# EAGLE design ACsaver-4 (EAGLE 5.11)
EAGLEUP: TC38H
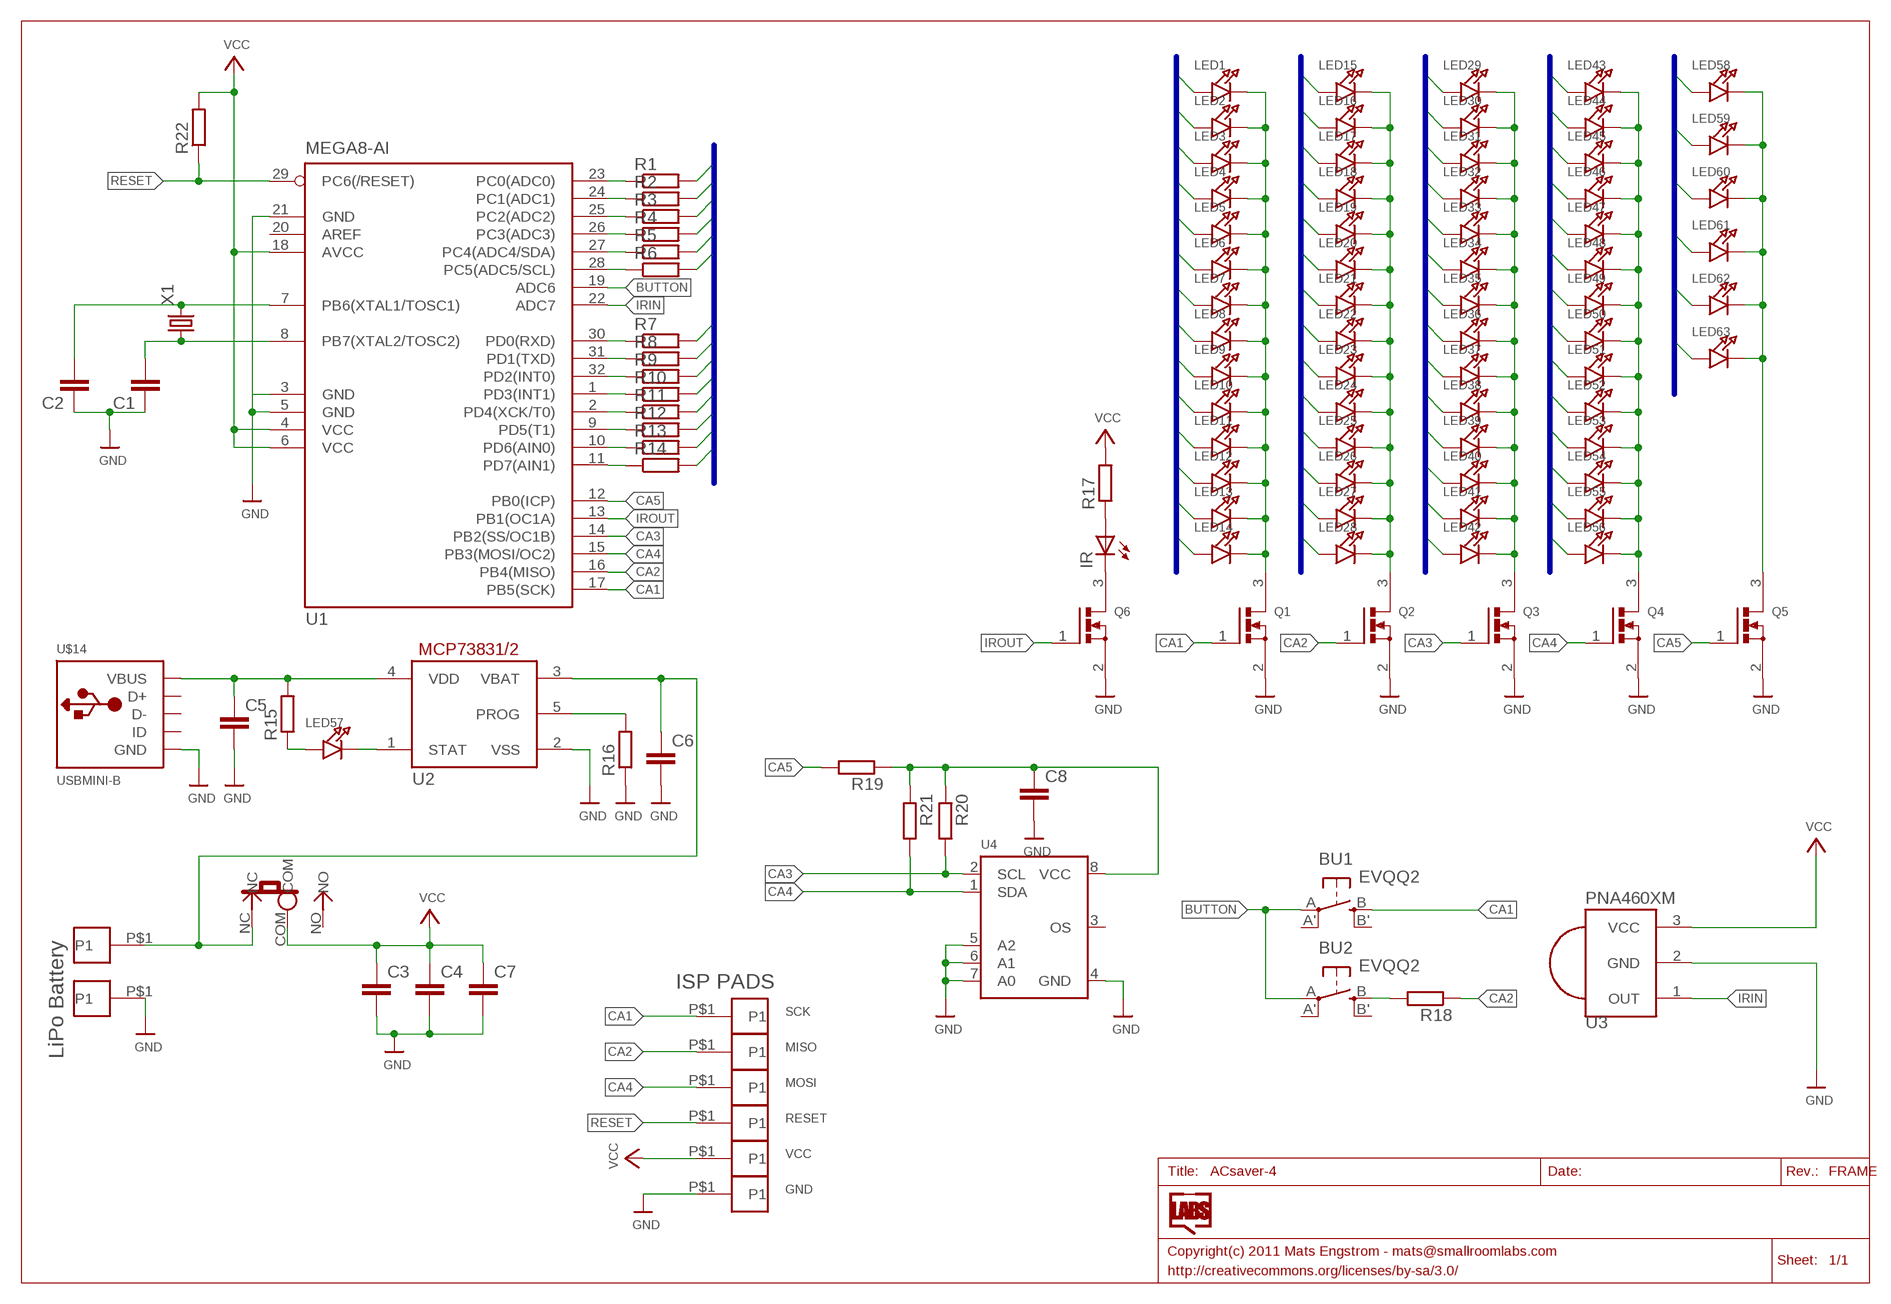
[diagram p0: schematic, sheet 1]

## Parts
BU1  EVQQ2  [EVQ-Q2]
BU2  EVQQ2  [EVQ-Q2]
C1  C-EUC0603  [C0603]
C2  C-EUC0603  [C0603]
C3  C-EUC0805  [C0805]
C4  C-EUC0805  [C0805]
C5  C-EUC0805  [C0805]
C6  C-EUC0805  [C0805]
C7  C-EUC0805  [C0805]
C8  C-EUC0805  [C0805]
IR  LED5MM  [LED5MM]
LED1  LED0805  [CHIPLED_0805]
LED2  LED0805  [CHIPLED_0805]
LED3  LED0805  [CHIPLED_0805]
LED4  LED0805  [CHIPLED_0805]
LED5  LED0805  [CHIPLED_0805]
LED6  LED0805  [CHIPLED_0805]
LED7  LED0805  [CHIPLED_0805]
LED8  LED0805  [CHIPLED_0805]
LED9  LED0805  [CHIPLED_0805]
LED10  LED0805  [CHIPLED_0805]
LED11  LED0805  [CHIPLED_0805]
LED12  LED0805  [CHIPLED_0805]
LED13  LED0805  [CHIPLED_0805]
LED14  LED0805  [CHIPLED_0805]
LED15  LED0805  [CHIPLED_0805]
LED16  LED0805  [CHIPLED_0805]
LED17  LED0805  [CHIPLED_0805]
LED18  LED0805  [CHIPLED_0805]
LED19  LED0805  [CHIPLED_0805]
LED20  LED0805  [CHIPLED_0805]
LED21  LED0805  [CHIPLED_0805]
LED22  LED0805  [CHIPLED_0805]
LED23  LED0805  [CHIPLED_0805]
LED24  LED0805  [CHIPLED_0805]
LED25  LED0805  [CHIPLED_0805]
LED26  LED0805  [CHIPLED_0805]
LED27  LED0805  [CHIPLED_0805]
LED28  LED0805  [CHIPLED_0805]
LED29  LED0805  [CHIPLED_0805]
LED30  LED0805  [CHIPLED_0805]
LED31  LED0805  [CHIPLED_0805]
LED32  LED0805  [CHIPLED_0805]
LED33  LED0805  [CHIPLED_0805]
LED34  LED0805  [CHIPLED_0805]
LED35  LED0805  [CHIPLED_0805]
LED36  LED0805  [CHIPLED_0805]
LED37  LED0805  [CHIPLED_0805]
LED38  LED0805  [CHIPLED_0805]
LED39  LED0805  [CHIPLED_0805]
LED40  LED0805  [CHIPLED_0805]
LED41  LED0805  [CHIPLED_0805]
LED42  LED0805  [CHIPLED_0805]
LED43  LED0805  [CHIPLED_0805]
LED44  LED0805  [CHIPLED_0805]
LED45  LED0805  [CHIPLED_0805]
LED46  LED0805  [CHIPLED_0805]
LED47  LED0805  [CHIPLED_0805]
LED48  LED0805  [CHIPLED_0805]
LED49  LED0805  [CHIPLED_0805]
LED50  LED0805  [CHIPLED_0805]
LED51  LED0805  [CHIPLED_0805]
LED52  LED0805  [CHIPLED_0805]
LED53  LED0805  [CHIPLED_0805]
LED54  LED0805  [CHIPLED_0805]
LED55  LED0805  [CHIPLED_0805]
LED56  LED0805  [CHIPLED_0805]
LED57  LED0805  [CHIPLED_0805]
LED58  LED0805  [CHIPLED_0805]
LED59  LED0805  [CHIPLED_0805]
LED60  LED0805  [CHIPLED_0805]
LED61  LED0805  [CHIPLED_0805]
LED62  LED0805  [CHIPLED_0805]
LED63  LED0805  [CHIPLED_0805]
P1  PAD5X7  [PAD5X7MM]
P2  PAD5X7  [PAD5X7MM]
P3  PADPAD1.5X2.5  [PAD1.5X2.5]
P4  PADPAD1.5X2.5  [PAD1.5X2.5]
P5  PADPAD1.5X2.5  [PAD1.5X2.5]
P6  PADPAD1.5X2.5  [PAD1.5X2.5]
P7  PADPAD1.5X2.5  [PAD1.5X2.5]
P8  PADPAD1.5X2.5  [PAD1.5X2.5]
Q1  MOSFET-NREFLOW  [SOT23-R]
Q2  MOSFET-NREFLOW  [SOT23-R]
Q3  MOSFET-NREFLOW  [SOT23-R]
Q4  MOSFET-NREFLOW  [SOT23-R]
Q5  MOSFET-NREFLOW  [SOT23-R]
Q6  MOSFET-NREFLOW  [SOT23-R]
R1  R-EU_R0603  [R0603]
R2  R-EU_R0603  [R0603]
R3  R-EU_R0603  [R0603]
R4  R-EU_R0603  [R0603]
R5  R-EU_R0603  [R0603]
R6  R-EU_R0603  [R0603]
R7  R-EU_R0603  [R0603]
R8  R-EU_R0603  [R0603]
R9  R-EU_R0603  [R0603]
R10  R-EU_R0603  [R0603]
R11  R-EU_R0603  [R0603]
R12  R-EU_R0603  [R0603]
R13  R-EU_R0603  [R0603]
R14  R-EU_R0603  [R0603]
R15  R-EU_R0603  [R0603]
R16  R-EU_R0603  [R0603]
R17  R-EU_R0603  [R0603]
R18  R-EU_R0603  [R0603]
R19  R-EU_R0603  [R0603]
R20  R-EU_R0603  [R0603]
R21  R-EU_R0603  [R0603]
R22  R-EU_R0603  [R0603]
SW1  SLIDESWITCH-PCM12  [PCM12]
U1  MEGA8-AI  [TQFP32-08]
U2  MCP73831/OT  [SOT23-5L]
U3  PNA460XM  [PNA460XM]
U4  LM75BSOIC  [SOIC8]
U$14  USBMINI-B  [MOLEX67503]
X1  CRYSTALTC26H  [TC26H]

## Nets
AN1: LED1.A LED15.A LED29.A LED43.A LED58.A R1.2
AN2: LED2.A LED16.A LED30.A LED44.A LED59.A R2.2
AN3: LED3.A LED17.A LED31.A LED45.A LED60.A R3.2
AN4: LED4.A LED18.A LED32.A LED46.A LED61.A R4.2
AN5: LED5.A LED19.A LED33.A LED47.A LED62.A R5.2
AN6: LED6.A LED20.A LED34.A LED48.A LED63.A R6.2
AN7: LED7.A LED21.A LED35.A LED49.A R7.2
AN8: LED8.A LED22.A LED36.A LED50.A R8.2
AN9: LED9.A LED23.A LED37.A LED51.A R9.2
AN10: LED10.A LED24.A LED38.A LED52.A R10.2
AN11: LED11.A LED25.A LED39.A LED53.A R11.2
AN12: LED12.A LED26.A LED40.A LED54.A R12.2
AN13: LED13.A LED27.A LED41.A LED55.A R13.2
AN14: LED14.A LED28.A LED42.A LED56.A R14.2
BUTTON: BU1.A(P) BU2.A(P) U1.19(ADC6)
CA1: BU1.B(S) P3.P$1(P1) Q1.1(G) U1.17(PB5(SCK))
CA2: P4.P$1(P1) Q2.1(G) R18.1 U1.16(PB4(MISO))
CA3: Q3.1(G) R20.2 U1.14(PB2(SS/OC1B)) U4.2(SCL)
CA4: P5.P$1(P1) Q4.1(G) R21.2 U1.15(PB3(MOSI/OC2)) U4.1(SDA)
CA5: Q5.1(G) R19.2 U1.12(PB0(ICP))
CABUS1: LED1.C LED2.C LED3.C LED4.C LED5.C LED6.C LED7.C LED8.C LED9.C LED10.C LED11.C LED12.C LED13.C LED14.C Q1.3(D)
CABUS2: LED15.C LED16.C LED17.C LED18.C LED19.C LED20.C LED21.C LED22.C LED23.C LED24.C LED25.C LED26.C LED27.C LED28.C Q2.3(D)
CABUS3: LED29.C LED30.C LED31.C LED32.C LED33.C LED34.C LED35.C LED36.C LED37.C LED38.C LED39.C LED40.C LED41.C LED42.C Q3.3(D)
CABUS4: LED43.C LED44.C LED45.C LED46.C LED47.C LED48.C LED49.C LED50.C LED51.C LED52.C LED53.C LED54.C LED55.C LED56.C Q4.3(D)
GND: C1.1 C2.1 C3.2 C4.2 C5.2 C6.2 C7.2 C8.2 P2.P$1(P1) P8.P$1(P1) Q1.2(S) Q2.2(S) Q3.2(S) Q4.2(S) Q5.2(S) Q6.2(S) R16.1 U1.3(GND) U1.5(GND) U1.21(GND) U2.2(VSS) U3.2(GND) U4.4(GND) U4.5(A2) U4.6(A1) U4.7(A0) U$14.GND
IRIN: U1.22(ADC7) U3.1(OUT)
IROUT: Q6.1(G) U1.13(PB1(OC1A))
N$1: R1.1 U1.23(PC0(ADC0))
N$2: R2.1 U1.24(PC1(ADC1))
N$3: R3.1 U1.25(PC2(ADC2))
N$4: R4.1 U1.26(PC3(ADC3))
N$5: R5.1 U1.27(PC4(ADC4/SDA))
N$6: R6.1 U1.28(PC5(ADC5/SCL))
N$7: R7.1 U1.30(PD0(RXD))
N$8: R8.1 U1.31(PD1(TXD))
N$9: R9.1 U1.32(PD2(INT0))
N$10: R10.1 U1.1(PD3(INT1))
N$11: R11.1 U1.2(PD4(XCK/T0))
N$12: R12.1 U1.9(PD5(T1))
N$13: R13.1 U1.10(PD6(AIN0))
N$14: R14.1 U1.11(PD7(AIN1))
N$15 [pwr]: IR.K(C) Q6.3(D)
N$16: IR.A R17.1
N$17 [pwr]: C5.1 R15.2 U2.4(VDD) U$14.VBUS
N$18 [pwr]: LED58.C LED59.C LED60.C LED61.C LED62.C LED63.C Q5.3(D)
N$19: LED57.A R15.1
N$20: LED57.C U2.1(STAT)
N$21: C2.2 U1.7(PB6(XTAL1/TOSC1)) X1.2
N$22: C1.2 U1.8(PB7(XTAL2/TOSC2)) X1.1
N$24: R16.2 U2.5(PROG)
N$25: BU2.B(S) R18.2
N$27: C8.1 R19.1 R20.1 R21.1 U4.8(VCC)
RESET: P6.P$1(P1) R22.1 U1.29(PC6(/RESET))
VBAT [pwr]: C6.1 P1.P$1(P1) SW1.NC U2.3(VBAT)
VCC [pwr]: C3.1 C4.1 C7.1 P7.P$1(P1) R17.2 R22.2 SW1.COM U1.4(VCC) U1.6(VCC) U1.18(AVCC) U3.3(VCC)
Unconnected: BU1.A'(P1) BU1.B'(S1) BU2.A'(P1) BU2.B'(S1) SW1.NO U1.20(AREF) U4.3(OS) U$14.D+ U$14.D- U$14.ID

## Buses
AN[1..14]

## Notes on the sheet
- ISP PADS
- SCK
- MISO
- LiPo Battery
- MOSI
- RESET
- VCC
- GND

## Library data of the parts
BU1 BU2 = adafruit:EVQQ2: SMT 6mm switch, EVQQ2 series http://www.ladyada.net/library/eagle
C1-C8 = rcl:C-EU: CAPACITOR, European symbol
IR = SparkFun:LED: LEDs Standard schematic elements and footprints for 5mm, 3mm, 1206, and 0603 sized LEDs. 5mm - Spark Fun Electronics SKU : COM-00529 (and others)
LED1-LED63 = microbuilder:LED: LED 0603 - 0603 Surface Mount Package Green LED - Low Power (3.9mcd, 2ma, 1.7Vf) Orange LED - Low Power (9.8mcd, 2ma, 1.8Vf) Red LED - Low Power (5mcd, 2ma, 1.8Vf) Yellow LED - Low Power (7mcd, 2ma, 1.8Vf) 0805 - 0805 Surface Mount Package 20mA: Red LED (104mcd, 20mA, Diffused) - LS R976 [Digikey: 475-1278-6-ND] Red LED (12mcd, 20mA, 2.0Vf, Clear) - APT2012EC [Digikey: 754-1128-1-ND] Green LED (15mcd, 20mA, 2.2Vf, Clear) - APT2012GC [Digikey: 754-1131-1-ND] Orange LED (160mcd, 20mA, 2.1Vf, Clear) - APT2012SECK [Digikey: 754-1130-1-ND] 2mA: Red LED (8.8mcd, 2mA, 1.8Vf, Clear) - Low Power [Digikey: 475-2510-1-ND] Green LED (5mcd, 2mA, 1.8Vf, Clear) - Low Power [Digikey: 475-2730-1-ND] Yellow LED (11.3mcd, 2mA, 1.8Vf, Clear) - Low Power [Digikey: 475-2555-1-ND] 1206 - 1206 Surface Mount Package Green LED (26mcd, 20mA, Diffused) - LG N971 [Digikey: 475-1407-6-ND] Red LED (15mcd, 20mA, Diffused) - LH N974 [Digikey: 475-1416-6-ND]
P1-P8 = SmallRoomLabs:PAD
Q1-Q6 = microbuilder:MOSFET-N: N-Channel Mosfet Digikey: 2N7002ET1GOSTR-ND
R1-R22 = resistor:R-EU_: RESISTOR, European symbol
SW1 = SmallRoomLabs:SLIDESWITCH
U1 = atmel:MEGA8: MICROCONTROLLER 8 Kbytes FLASH, 1 kbytes SRAM, 512 bytes EEPROM, USART, 6-channel 10 bit ADC, 2-channel 8 bit ADC Pin compatible with Atmega48, ATMega88, ATMega168 Source: avr.lbr; MPN: ATMEGA8-16AU; OC_FARNELL: 9171371; OC_NEWARK: 73M8863
U2 = adafruit:MCP73831: MCP73831/2 Miniature Single-Cell, Fully Integrated Li-Ion, Li-Polymer Charge Management Controllers. Nice and small simple lipoly charge controller, with adjustable current and status output (LED) http://www.ladyada.net/library/pcb/eaglelibrary.html
U3 = adafruit:PNA460XM: IR 38KHz receiver PNA4602 and related receivers http://www.ladyada.net/library/pcb/eaglelibrary.html
U4 = microbuilder:LM75B: LM75B I2C Temperature Sensor The I2C-based LM75B can measure temperature between -55 and 125°C in 0.125°C increments (11-bit resolution). Digikey: 568-4768-1-ND
U$14 = SmallRoomLabs:USB
X1 = crystal:CRYSTAL: CRYSTAL; OC_FARNELL: unknown; OC_NEWARK: unknown

## Net classes
0 default: width 0.203 mm, drill 0.305 mm, clearance 0.203 mm
1 pwr: width 0.203 mm, drill 0.305 mm, clearance 0.203 mm

## Board
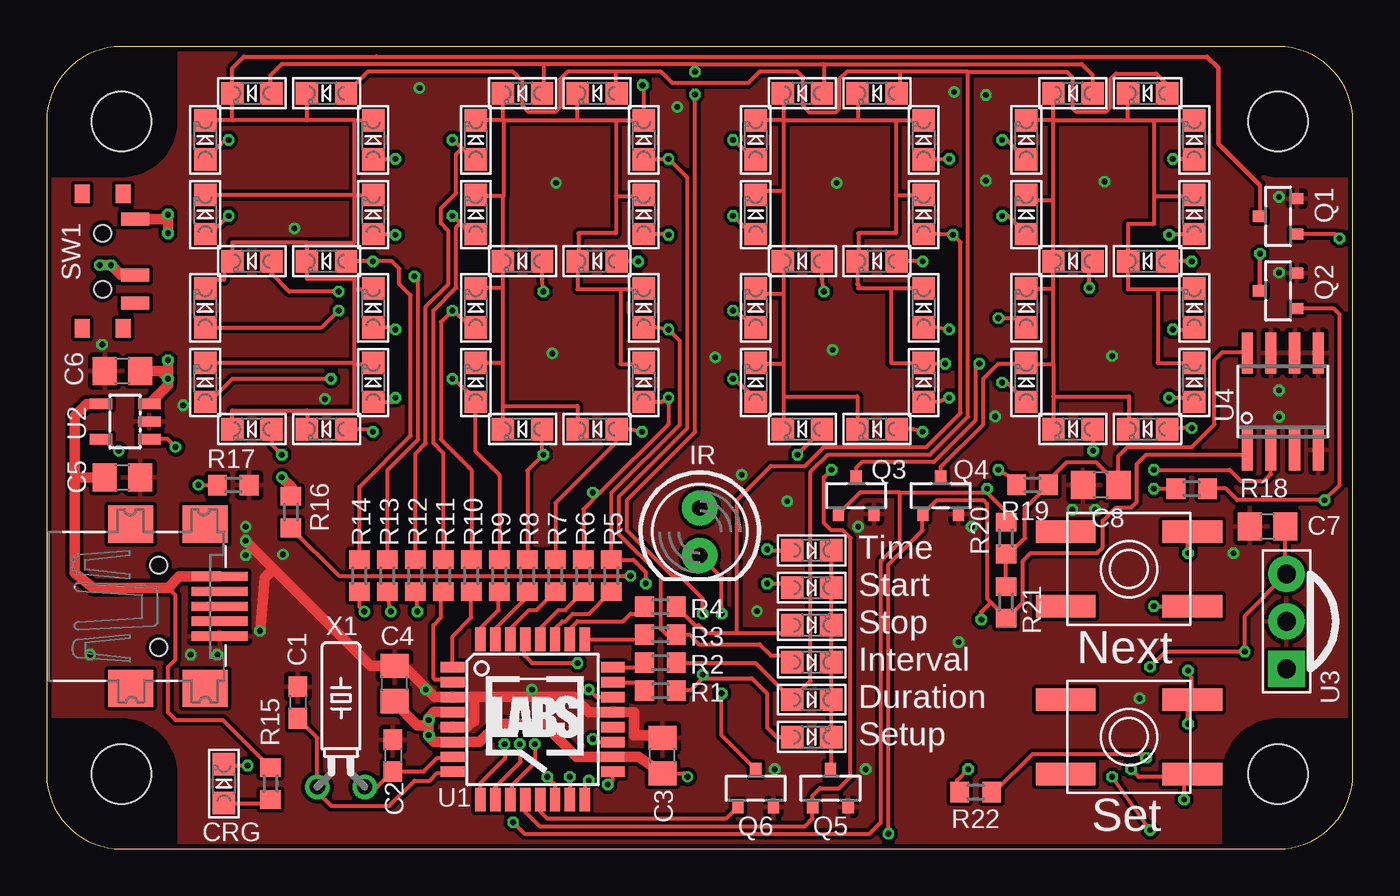
[diagram p1: board, top side]
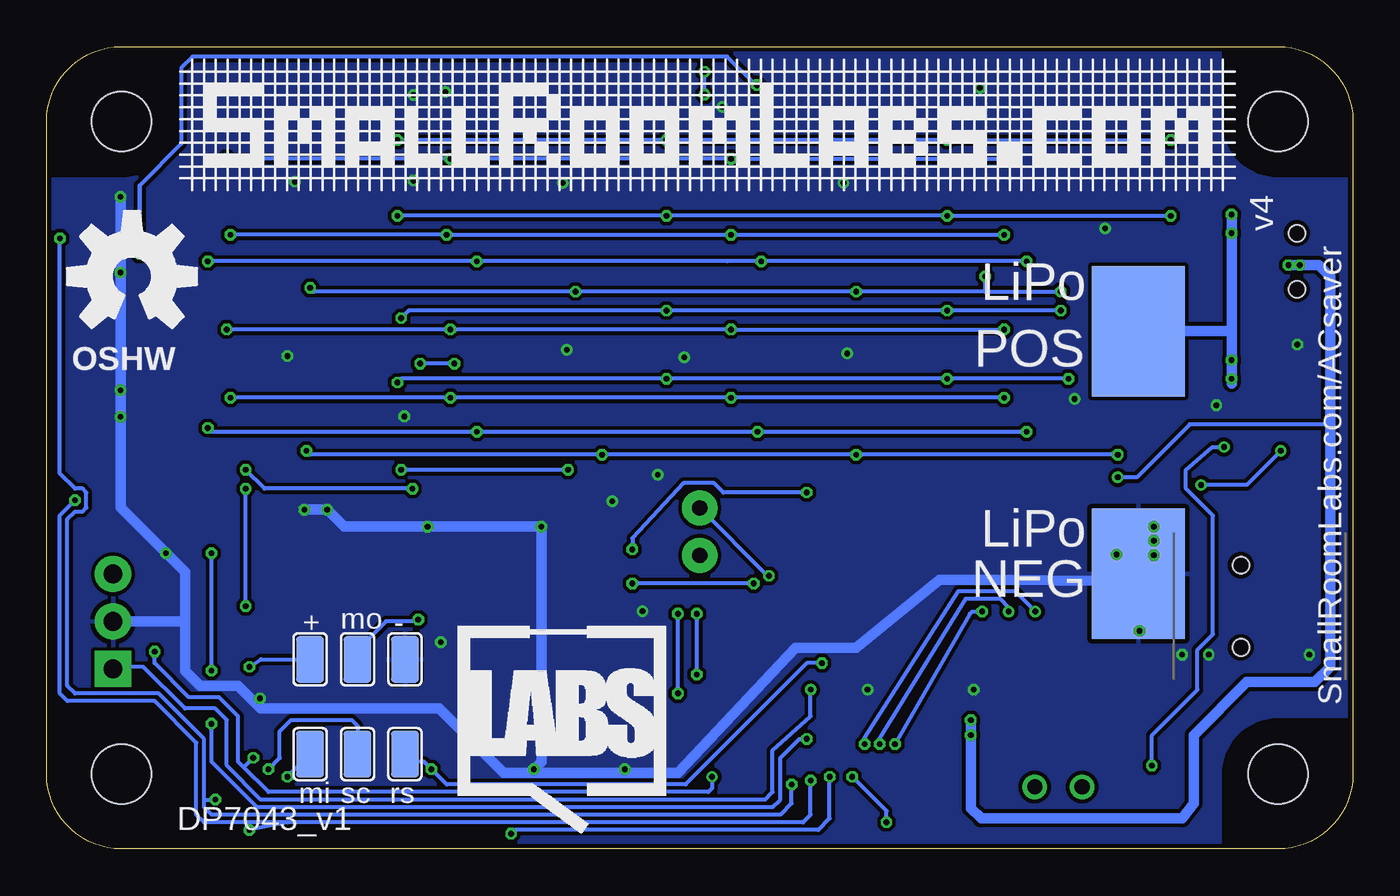
[diagram p2: board, bottom side, seen from below]

Size 70 x 43 mm. Coordinates in mm from the lower left corner, seen from the top.
Copper layers (1*16): Top 0.035mm / dielectric 1.5mm / Bottom 0.035mm
Design rules "Fusion_eagle_rule_v1.1": minimum track width 6mil, minimum drill 12mil, track to track 6mil, track to pad 6mil, pad to pad 6mil, via to via 6mil, smd to smd 0mil, copper to edge 10mil, drill to drill 10mil, minimum pad ring 10mil, minimum via ring 6mil, stop-mask expansion 2mil, vias tented up to drill 100mil, thermal gap 10mil

### Footprints (pad centres in the part's own frame; a part is rotated, then mirrored left to right if it is on the bottom)
EVQ-Q2 = smd 3.2 x 1.2: A -3.4,-2; A' 3.4,-2; B -3.4,2; B' 3.4,2
C0603 = smd 1.1 x 1: 1 -0.85,0; 2 0.85,0
C0805 = smd 1.3 x 1.5: 1 -0.95,0; 2 0.95,0
LED5MM = drill 0.813 pad 1.88 round: A -1.27,0; K 1.27,0
CHIPLED_0805 = smd 1.2 x 1.2: A 0,-1.05; C 0,1.05
PAD5X7MM = smd 7 x 5: P$1 0,0
PAD1.5X2.5 = smd 1.5 x 2.5: P$1 0,0
SOT23-R = smd 0.6 x 0.7: 1 -0.95,-1; 2 0.95,-1; 3 0,1
R0603 = smd 1 x 1.1: 1 -0.85,0; 2 0.85,0
PCM12 = smd 0.7 x 1.5: COM 0.75,1.75; NC -2.25,1.75; NO 2.25,1.75 | smd 1 x 0.8: P$1 -3.6,-1.1; P$2 -3.6,1.1; P$3 3.6,1.1; P$4 3.6,-1.1 | hole 0.9: -1.5,0; 1.5,0
TQFP32-08 = smd 1.27 x 0.559: 1 -4.293,2.8; 2 -4.293,2; 3 -4.293,1.2; 4 -4.293,0.4; 5 -4.293,-0.4; 6 -4.293,-1.2; 7 -4.293,-2; 8 -4.293,-2.8; 17 4.293,-2.8; 18 4.293,-2; 19 4.293,-1.2; 20 4.293,-0.4; 21 4.293,0.4; 22 4.293,1.2; 23 4.293,2; 24 4.293,2.8 | smd 0.559 x 1.27: 9 -2.8,-4.293; 10 -2,-4.293; 11 -1.2,-4.293; 12 -0.4,-4.293; 13 0.4,-4.293; 14 1.2,-4.293; 15 2,-4.293; 16 2.8,-4.293; 25 2.8,4.293; 26 2,4.293; 27 1.2,4.293; 28 0.4,4.293; 29 -0.4,4.293; 30 -1.2,4.293; 31 -2,4.293; 32 -2.8,4.293
SOT23-5L = smd 0.55 x 1.2: 1 -0.95,-1.3; 2 0,-1.3; 3 0.95,-1.3; 4 0.95,1.3; 5 -0.95,1.3
PNA460XM = drill 1.016 pad 1.93 square: 1 -2.54,0 | drill 1.016 pad 1.93 round: 2 0,0; 3 2.54,0
SOIC8 = smd 0.6 x 2.2: 1 -1.905,-2.6; 2 -0.635,-2.6; 3 0.635,-2.6; 4 1.905,-2.6; 5 1.905,2.6; 6 0.635,2.6; 7 -0.635,2.6; 8 -1.905,2.6
DP7043_V1 = hole 3.2: 4,4; 66,4; 66,39; 4,39
MOLEX67503 = smd 0.5 x 3: D+ 0,3.264; D- -0.8,3.264; GND 1.6,3.264; ID 0.8,3.264; VBUS -1.6,3.264 | smd 2 x 2.4: GND1 -4.4,-1.5; GND2 -4.4,2.5; GND3 4.4,2.5; GND4 4.4,-1.5 | hole 0.9: -2.2,0; 2.2,0
TC26H = drill 0.813 round: 1 -1.27,0; 2 1.27,0

### Placement (x,y rotation side)
BU1  58,6 180 top
BU2  58,15 180 top
C1  13.46,7.84 270 top
C2  18.55,5 270 top
C3  33,5 90 top
C4  18.64,8.86 90 top
C5  4.06,19.91 0 top
C6  4.06,25.6 180 top
C7  65.43,17.27 180 top
C8  56.49,19.51 180 top
IR  35,17 270 top
LED1  11,40.5 90 top
LED2  15,40.5 90 top
LED3  17.5,38 0 top
LED4  17.5,34 0 top
LED5  17.5,29 0 top
LED6  17.5,25 0 top
LED7  15,22.5 90 top
LED8  11,22.5 90 top
LED9  8.5,25 0 top
LED10  8.5,29 0 top
LED11  8.5,34 0 top
LED12  8.5,38 0 top
LED13  11,31.5 90 top
LED14  15,31.5 90 top
LED15  25.5,40.5 90 top
LED16  29.5,40.5 90 top
LED17  32,38 0 top
LED18  32,34 0 top
LED19  32,29 0 top
LED20  32,25 0 top
LED21  29.5,22.5 90 top
LED22  25.5,22.5 90 top
LED23  23,25 0 top
LED24  23,29 0 top
LED25  23,34 0 top
LED26  23,38 0 top
LED27  25.5,31.5 90 top
LED28  29.5,31.5 90 top
LED29  40.5,40.5 90 top
LED30  44.5,40.5 90 top
LED31  47,38 0 top
LED32  47,34 0 top
LED33  47,29 0 top
LED34  47,25 0 top
LED35  44.5,22.5 90 top
LED36  40.5,22.5 90 top
LED37  38,25 0 top
LED38  38,29 0 top
LED39  38,34 0 top
LED40  38,38 0 top
LED41  40.5,31.5 90 top
LED42  44.5,31.5 90 top
LED43  55,40.5 90 top
LED44  59,40.5 90 top
LED45  61.5,38 0 top
LED46  61.5,34 0 top
LED47  61.5,29 0 top
LED48  61.5,25 0 top
LED49  59,22.5 90 top
LED50  55,22.5 90 top
LED51  52.5,25 0 top
LED52  52.5,29 0 top
LED53  52.5,34 0 top
LED54  52.5,38 0 top
LED55  55,31.5 90 top
LED56  59,31.5 90 top
LED57  9.5,3.5 0 top
LED58  41,6 270 top
LED59  41,8 270 top
LED60  41,10 270 top
LED61  41,12 270 top
LED62  41,14 270 top
LED63  41,16 270 top
P1  11.5,27.75 270 bottom
P2  11.5,14.75 270 bottom
P3  53.34,5.08 0 bottom
P4  55.88,5.08 0 bottom
P5  53.34,10.16 0 bottom
P6  50.8,5.08 0 bottom
P7  55.88,10.16 0 bottom
P8  50.8,10.16 0 bottom
Q1  66,33.91 90 top
Q2  66,29.91 90 top
Q3  43.38,18.94 0 top
Q4  47.92,18.94 0 top
Q5  42,3.25 0 top
Q6  38,3.25 0 top
R1  32.89,8.48 0 top
R2  32.89,9.98 0 top
R3  32.89,11.48 0 top
R4  32.89,12.98 0 top
R5  30.27,14.64 90 top
R6  28.77,14.64 90 top
R7  27.27,14.64 90 top
R8  25.77,14.64 90 top
R9  24.27,14.64 90 top
R10  22.77,14.64 90 top
R11  21.27,14.64 90 top
R12  19.77,14.64 90 top
R13  18.27,14.64 90 top
R14  16.77,14.64 90 top
R15  12,3.5 90 top
R16  10,19.5 180 top
R17  13.09,18.05 90 top
R18  61.37,19.3 180 top
R19  52.83,19.51 180 top
R20  51.41,16.66 90 top
R21  51.41,13.21 270 top
R22  49.78,3.05 0 top
SW1  3,31.5 270 top
U1  26.05,6.93 0 top
U2  4.2,22.91 90 top
U3  66.45,12.19 90 top
U4  66.24,23.98 0 top
U$2  [DP7043_V1]  0,0 0 top
U$14  6,13 270 top
U$23  [SRL-LOGO-TPLACE-5MM]  23.57,4.06 0 top
U$24  [SRL-PIXELART-1]  61.57,36.58 0 bottom
U$25  [SRL-LOGO-SILK-10MM]  47.96,0.81 0 bottom
U$26  [OSHW-LOGO-L]  65.43,30.68 0 bottom
X1  15.78,3.32 0 top

### Tracks (layer width: path | path; a pad name or v marks a point on that pad's centre or on a via)
AN1  (via drill 0.3)
  Top 0.203: 33.88,8.48 R1.2 33.79,8.53 34.54,8.53 35.15,9.14 35.36,9.14 | LED1.A 11.99,40.56 11.99,41.45 12.6,42.06 26.62,42.06 | 34.75,42.06 26.62,42.06 | 34.75,42.06 41.66,42.06 | 41.66,42.06 55.47,42.06 56.05,41.49 LED43.A | LED29.A 41.66,40.61 41.66,42.06 | LED15.A 26.62,40.57 26.62,42.06 | LED58.A 39.11,6 38.61,6.5 38.61,8.33 37.8,9.14 35.36,9.14 | 35.36,9.14 v35.15,9.35 | v34.75,40.44 34.75,22.35 31.09,18.69 31.09,17.07 33.53,14.63 33.93,14.63 35.15,13.41 v35.15,12.6 | v34.75,41.66 34.75,42.06
  Bottom 0.203: v35.15,9.35 v35.15,12.6 | v34.75,40.44 v34.75,41.66
AN2
  Top 0.203: LED2.A 17.21,41.66 24.99,41.66 25.5,41.15 25.5,39.83 25.83,39.5 27.25,39.5 27.51,39.75 27.51,41.25 27.91,41.66 30.48,41.66 | 45.72,41.66 42.88,41.66 42.47,41.25 42.47,39.67 42.27,39.47 40.87,39.47 40.54,39.85 40.54,41.35 40.23,41.66 38.2,41.66 37.59,41.05 33.53,41.05 32.92,41.66 30.48,41.66 | 49.38,41.66 45.72,41.66 | 49.38,41.66 54.66,41.66 54.97,41.35 54.97,39.7 55.14,39.52 56.79,39.52 57,39.75 57,41.25 57.3,41.55 59.46,41.55 60.05,40.97 LED44.A | LED30.A 45.72,40.67 45.72,41.66 | LED16.A 30.48,40.57 30.48,41.66 | R2.2 33.77,9.96 38,9.96 38.81,9.14 LED59.A 40.95,8.99 40.95,20.22 41.86,21.13 47.35,21.13 49.38,23.16 49.38,41.66
AN3  (via drill 0.3)
  Top 0.203: LED3.A 18.66,36.95 v18.69,36.98 | v60.35,36.98 61.47,36.98 LED45.A | LED31.A 47.78,36.95 v48.36,36.98 | LED17.A 32.75,36.95 v33.33,36.98 34.34,35.97 34.34,22.55 30.68,18.9 30.68,16.87 32.92,14.63 32.92,11.79 33.22,11.48 R3.2 34.44,11.48 34.95,10.97 38.2,10.97 38.81,10.36 39.59,10.36 LED60.A
  Bottom 0.203: v18.69,36.98 v33.33,36.98 v48.36,36.98 v60.35,36.98
AN4  (via drill 0.3)
  Top 0.203: LED61.A 39.53,11.58 36.98,11.58 | LED46.A 60.18,32.95 v60.15,32.92 | v18.69,32.92 17.53,32.92 LED4.A | LED18.A 33.09,32.95 v33.33,32.92 | LED32.A 47.92,32.95 v48.56,32.92 48.97,32.51 48.97,23.37 47.14,21.54 41.66,21.54 40.64,20.52 38.81,20.52 36.98,18.69 36.98,11.58 | 36.98,11.58 35.36,11.58 34.95,11.99 34.74,11.99 R4.2
  Bottom 0.203: v18.69,32.92 v33.33,32.92 v48.56,32.92 v60.15,32.92
AN5  (via drill 0.3)
  Top 0.203: LED5.A 18.58,27.95 v18.69,27.84 | v60.35,27.84 61.39,27.84 LED47.A | LED19.A 32.6,27.95 v33.33,27.84 33.93,27.23 33.93,22.76 30.27,19.09 R5.2 31.45,15.49 32.11,14.83 v32.11,14.22 | LED33.A 47.64,27.95 v48.36,27.84 | v38.61,14.22 39.73,14.22 LED62.A
  Bottom 0.203: v18.69,27.84 v33.33,27.84 v48.36,27.84 v60.35,27.84 | v32.11,14.22 v38.61,14.22
AN6  (via drill 0.3)
  Top 0.203: LED6.A 18.46,23.95 v18.69,24.18 | v60.15,24.18 61.27,24.18 LED48.A | LED34.A 47.78,23.95 v48.36,24.18 | LED20.A 32.95,23.95 v33.33,24.18 33.33,22.76 29.67,19.1 | R6.2 28.77,18.2 29.67,19.1 | LED63.A 38.66,16 v38.61,16.05 | 29.67,19.1 v29.26,19.1
  Bottom 0.203: v18.69,24.18 v33.33,24.18 v48.36,24.18 v60.15,24.18 | v38.61,16.05 38.61,16.66 35.87,19.61 34.24,19.61 33.73,19.1 v29.26,19.1
AN7  (via drill 0.3)
  Top 0.203: LED7.A 17.33,22.5 v17.48,22.35 | v61.37,22.55 60.1,22.55 LED49.A | LED35.A 46.38,22.5 v46.94,22.35 | v31.9,22.35 31.14,22.5 LED21.A 30.48,22.43 30.48,21.74 27.27,18.53 R7.2
  Bottom 0.203: v17.48,22.35 v31.9,22.35 v46.94,22.35 61.16,22.35 v61.37,22.55
AN8  (via drill 0.3)
  Top 0.203: LED8.A 12.05,21.68 v12.6,21.13 | v56.08,21.34 56.08,22.47 LED50.A | LED36.A 41.55,22.46 v40.23,21.13 | LED22.A 26.55,21.2 v26.62,21.13 25.77,20.28 R8.2
  Bottom 0.203: v12.6,21.13 v26.62,21.13 v40.23,21.13 55.88,21.13 v56.08,21.34
AN9  (via drill 0.3)
  Top 0.203: LED9.A 8.71,23.95 9.96,25.2 v15.24,25.2 | v51.21,24.99 51.46,24.99 LED51.A | LED37.A 38,24.18 v36.78,25.2 | v21.74,25.2 23,24.14 LED23.A 22.96,23.91 22.96,21.34 24.27,20.03 R9.2
  Bottom 0.203: v15.24,25.2 v21.74,25.2 v36.78,25.2 51,25.2 v51.21,24.99
AN10  (via drill 0.3)
  Top 0.203: LED10.A 14.74,27.95 v15.65,28.85 | v51,28.45 52,28.45 LED52.A | LED24.A 22.85,27.95 v21.74,28.85 21.13,28.25 21.13,21.95 22.77,20.31 R10.2 | LED38.A 38,28.04 v36.78,28.85
  Bottom 0.203: v15.65,28.85 v21.74,28.85 v36.78,28.85 50.6,28.85 v51,28.45
AN11  (via drill 0.3)
  Top 0.203: LED11.A 8.77,32.95 v9.75,33.93 | v51.21,33.93 51.52,33.93 LED53.A | LED25.A 22.73,32.95 22.15,33.53 | 22.15,33.53 v21.74,33.93 | LED39.A 37.76,32.95 v36.78,33.93 | R11.2 21.27,21.2 20.73,21.74 20.73,28.85 21.95,30.07 21.95,33.33 22.15,33.53
  Bottom 0.203: v9.75,33.93 v21.74,33.93 v36.78,33.93 v51.21,33.93
AN12  (via drill 0.3)
  Top 0.203: LED12.A 9.55,38 v9.75,38 | v51.21,38 51.45,38 LED54.A | LED26.A 22.26,37.56 | 22.26,37.56 v21.74,38 | LED40.A 38,36.98 v36.78,38 | R12.2 19.77,21.19 20.32,21.74 20.32,29.06 21.54,30.28 21.54,33.12 21.13,33.53 21.13,34.34 21.95,35.15 21.95,37.25 22.26,37.56
  Bottom 0.203: v9.75,38 v21.74,38 v36.78,38 v51.21,38
AN13  (via drill 0.3)
  Top 0.203: LED13.A 12.05,30.82 13.01,29.87 v15.65,29.87 | v55.88,30.07 55.88,31.33 LED55.A | LED27.A 26.55,30.55 v26.62,29.87 | LED41.A 41.55,30.59 v41.66,29.87 | R13.2 18.27,20.3 19.91,21.95 19.91,30.48 v19.71,30.68
  Bottom 0.203: 19.71,29.87 v15.65,29.87 | 19.71,29.87 v26.62,29.87 v41.66,29.87 55.68,29.87 v55.88,30.07 | v19.71,30.68 19.71,29.87
AN14  (via drill 0.3)
  Top 0.203: LED14.A v17.47,31.5 v17.48,31.5 18.49,31.5 18.9,31.09 18.9,30.28 19.51,29.67 19.51,22.15 16.77,19.41 R14.2 | v61.37,31.5 LED56.A | LED42.A v46.94,31.5 | LED28.A 31.09,31.5 v31.7,31.5
  Bottom 0.203: v17.48,31.5 v31.7,31.5 | v31.7,31.5 v46.94,31.5 v61.37,31.5 | v31.7,31.5 33.53,31.5
BUTTON  (via drill 0.3)
  Top 0.203: U1.19 29.42,5.73 v29.26,5.89 | v61.16,6.71 61.16,7.76 BU1.A 61.37,9.14 v61.16,9.55 | v61.16,15.85 61.16,16.76 BU2.A
  Bottom 0.203: v29.26,5.89 29.67,5.89 30.68,4.88 30.68,2.64 31.09,2.23 58.73,2.23 61.16,4.67 v61.16,6.71 | v61.16,9.55 v61.16,15.85
CA1  (via drill 0.3)
  Top 0.203: U1.17 30.34,3.72 v30.07,3.45 | v69.29,32.72 69.05,32.96 Q1.1 | v60.96,2.64 60.96,3.56 BU1.B 61.26,3.86 58.52,3.86 v58.12,4.27
  Bottom 0.203: v30.07,3.45 30.07,2.44 30.68,1.83 61.16,1.83 61.57,2.23 61.57,2.64 | 61.57,2.64 61.57,5.89 64.01,8.33 68.48,8.33 68.89,8.74 68.89,17.68 68.48,18.09 68.07,18.09 67.87,18.29 67.87,19.1 68.07,19.3 68.48,19.3 69.29,20.12 v69.29,32.72 | 61.57,2.64 v60.96,2.64 | P3.P$1 53.34,6.6 53.65,6.91 56.9,6.91 57.51,6.3 57.51,4.88 v58.12,4.27
CA2  (via drill 0.3)
  Top 0.203: U1.16 28.85,3.45 v29.06,3.66 | Q2.1 68.99,28.96 69.29,28.65 69.29,19.51 v68.48,18.69 63.8,18.69 63.2,19.3 R18.1 | v59.13,1.02 v57.1,3.86
  Bottom 0.203: v29.06,3.66 29.06,1.83 29.46,1.42 57.1,1.42 | 57.1,1.42 61.57,1.42 61.98,1.83 61.98,5.69 64.21,7.92 68.89,7.92 69.29,8.33 69.29,17.88 v68.48,18.69 | v57.1,3.86 P4.P$1 | 57.1,1.42 v59.13,1.02
CA3  (via drill 0.3)
  Top 0.203: R20.2 51.37,17.51 51.37,18.12 50.39,19.1 | 45.72,19.1 43.59,19.1 Q3.1 | 45.72,19.1 50.39,19.1 | U4.2 65.61,20.09 65.23,19.71 64.01,19.71 63.4,20.32 v59.33,20.32 | 50.39,19.1 v50.39,19.3 | U1.14 27.25,3.44 v26.82,3.86 | v24.99,1.42 25.6,0.81 44.09,0.81 44.7,1.42 44.7,15.44 45.72,16.46 45.72,19.1
  Bottom 0.203: v59.33,20.32 58.32,19.3 v50.39,19.3 | v26.82,3.86 24.99,2.03 v24.99,1.42
CA4  (via drill 0.3)
  Top 0.203: 50.6,13.21 50.39,13.41 50.39,18.49 50.19,18.69 47.72,18.69 Q4.1 46.94,17.91 46.94,17.07 45.11,15.24 v45.11,0.81 | 50.6,13.21 51.41,12.39 R21.2 51.47,12.36 52.32,13.21 52.32,15.44 52.73,15.85 56.29,15.85 56.59,16.15 56.59,17.58 57.3,18.29 58.12,18.29 58.42,18.59 58.42,20.62 58.93,21.13 64.09,21.13 U4.1 | U1.15 v28.05,3.85 v28.04,3.86 | v50.09,12.29 50.09,12.7 50.6,13.21
  Bottom 0.203: v28.04,3.86 28.04,1.63 28.65,1.02 44.91,1.02 v45.11,0.81 | P5.P$1 53.34,11.28 52.73,11.28 51.82,12.19 50.19,12.19 v50.09,12.29
CA5  (via drill 0.3)
  Top 0.203: U1.12 25.65,1.99 26.42,1.22 40.64,1.22 41.05,1.63 Q5.1 41.05,2.85 41.45,3.25 42.47,3.25 43.08,3.86 43.08,16.66 42.67,17.07 42.06,17.07 41.66,17.48 41.66,19.91 v42.06,20.32 | R19.2 51.98,19.75 v51,20.32
  Bottom 0.203: v42.06,20.32 v51,20.32
CABUS1
  Top 0.203: 65,35.58 Q1.3 | 62.18,42.47 17.68,42.47 10.57,42.47 9.95,41.85 LED1.C 9.95,39.05 | 17.68,39.23 LED3.C 16.5,39.05 | 16.5,39.05 13.95,39.05 | 13.95,39.05 LED2.C | 13.95,39.05 9.95,39.05 | 9.95,39.05 LED12.C | LED8.C 9.95,23.5 13.95,23.5 | 13.95,23.5 LED7.C | LED6.C 17.5,26 16.5,26 | 16.5,26 16.5,23.5 13.95,23.5 | 16.5,26.05 16.5,30 | 16.5,30 16.5,30.55 13.95,30.55 LED14.C 13.95,32.5 | 16.5,35.05 LED4.C | 16.5,35.05 16.5,39.05 | 16.5,26.05 LED9.C | 16.5,26 16.5,26.05 | 16.5,35.05 LED11.C | 13.95,32.5 16.5,32.5 16.5,35.05 | 13.95,32.5 9.95,32.5 LED13.C 9.5,31.5 9.5,30.5 8.5,30.5 LED10.C | LED5.C 17.5,30 16.5,30
  Top 0.254: 65,35.58 62.79,37.8 62.79,41.86 62.18,42.47
CABUS2  (via drill 0.3)
  Top 0.203: 24.45,39.05 LED26.C | 24.45,39.05 LED15.C | 28.45,39.05 LED16.C | 24.5,39.05 28.45,39.05 | 30.5,39.05 LED17.C 32,41 v31.94,40.94 | LED18.C 32,35 30.5,35 | 30.5,39.05 30.5,35 | 28.45,39.05 30.5,39.05 | LED25.C 23,35 24.45,35 | 24.5,39.05 24.5,35 24.45,35 | 24.5,39.05 24.45,39.05 | 24.45,35 LED27.C 24.45,30.05 | 24.45,30.05 LED24.C | 24.45,26.05 LED23.C | 24.45,26.05 24.45,30.05 | LED22.C 24.45,23.75 | 24.45,23.75 24.45,26.05 | LED21.C 28.45,23.75 24.45,23.75 | LED20.C 32,26 30.75,26 30.75,30 | 30.75,30 32,30 LED19.C | 30.5,35 30.5,33 28.5,33 28.5,31.5 LED28.C 28.45,30 30.75,30
  Top 0.254: Q2.3 65,31.88 v65.02,31.9
  Bottom 0.203: 65.02,35.56 62.79,37.8 62.79,41.86 62.18,42.47 33.53,42.47 32,40.94 v31.94,40.94
  Bottom 0.254: 65.02,35.56 v65.02,31.9
CABUS3  (via drill 0.3)
  Top 0.203: 39.5,39.05 LED40.C | 39.5,39.05 43.5,39.05 | 43.5,39.05 45.5,39.05 | 45.5,39.05 LED31.C | LED29.C 39.5,40.45 39.5,39.05 | LED30.C 43.5,40.45 43.5,39.05 | 39.5,35.25 39.5,31.55 LED41.C 39.5,31.5 39.5,29.75 | 39.5,35.25 39.5,39.05 | LED39.C 38.2,35.25 39.5,35.25 | 45.5,35.05 LED32.C | 45.5,39.05 45.5,35.05 | 45.5,35.05 45.5,33 43.5,33 43.5,31.5 LED42.C 43.45,30.25 43.5,30.25 43.5,30.05 45.25,30.05 | 45.25,30.05 LED33.C | 45.25,30.05 45.25,26.05 LED34.C 47.04,26.01 v48.16,26.01 | LED35.C 43.45,24.25 39.5,24.25 | 39.5,24.25 39.5,22.5 LED36.C | 39.5,24.25 39.5,26 | 39.5,26 39.5,29.75 | LED38.C 38,29.75 39.5,29.75 | LED37.C 38,26 39.5,26 | Q3.3 43.38,20.42 43.69,20.73 47.55,20.73 49.78,22.96 49.78,25.81 v49.99,26.01
  Bottom 0.203: v48.16,26.01 v49.99,26.01
CABUS4
  Top 0.203: 53.95,39.05 LED54.C | 53.95,34.75 LED55.C 53.95,30 | 53.95,34.75 53.95,39.05 | 53.95,39.05 57.95,39.05 | LED53.C 52.5,34.75 53.95,34.75 | 53.95,39.05 LED43.C | 57.95,39.05 LED44.C | 59.34,39.05 LED45.C | 59.34,39.05 59.34,35 | 59.34,35 59.34,33.5 57.95,33.5 LED56.C 57.95,30 59.55,30 | 57.95,39.05 59.34,39.05 | LED46.C 61.5,35 59.34,35 | 53.95,26 53.95,24.25 | 53.95,26 53.95,30 | 53.95,24.25 58,24.25 58,22.5 LED49.C | 53.95,24.25 LED50.C | 53.95,26 52.5,26 LED51.C 52.46,26.01 51,26.01 50.19,25.2 50.19,22.76 47.92,20.48 Q4.3 | LED52.C 52.5,30 53.95,30 | 59.55,30 59.55,26.05 LED48.C 61.7,26.05 | 59.55,30 61.5,30 LED47.C
GND  (via drill 0.3)
  Top 0.55: 22.91,8.13 U1.3 20.8,8.13 19.25,9.68 18.78,9.68 C4.2 17.36,9.81 12.17,15.01 | 22.91,8.13 22.91,6.91 | 22.91,6.91 22.91,6.83 | U1.21 31.48,7.33 31.48,6.08 32.8,6.08 C3.2 | U1.5 22.54,6.53 22.91,6.91 | 22.91,8.13 28.24,8.13 29.06,7.32 30.87,7.32 | 12.17,15.01 v10.67,16.51 | v11.43,11.68 11.68,14.53 12.17,15.01
  Bottom 0.55: P2.P$1 13.87,14.37 18.29,14.43 22.15,14.43 26.62,10.77 29.87,10.77 36.17,4.06 45.52,4.06 48.97,7.52 58.52,7.52 59.74,8.74 61.77,8.74 62.59,9.55 62.59,12.19 | v56.19,18.19 v54.97,18.19 54.05,17.27 v43.48,17.27 43.48,4.67 v43.89,4.27 | 62.59,12.19 62.59,14.83 66.04,18.29 66.04,34.91 | 62.59,12.19 U3.2
  other vias: 9.14,10.41 10.67,15.75 10.67,17.27 12.67,15.78 7.32,23.77 2.97,27.03 2.34,10.41 20.32,8.53 26.01,8.53 58.56,8.07 39.01,4.27 48.87,11.07 7.72,10.41 66.04,34.95 66.04,30.89 66.04,24.59 63.6,15.85 14.9,24.12 27.1,26.55 42.13,26.76 35.83,26.35 42.34,35.7 27.3,35.7 19.98,40.78 13.28,33.26 48.63,40.57 38.07,12.74 39.69,18.63 37.26,20.05 33.8,39.76 49.58,17.27 66.04,23.16 56.69,35.76 57.1,26.42 50.34,40.41 50.34,35.82 50.83,23.18
  pour Top: 0,21 0,39 arc-90 4,43 38,43 66,43 arc-90 70,39 70,18 70,4 arc-90 66,0 35,0 4,0 arc-90 0,4
  pour Bottom: 0,21 0,39 arc-90 4,43 35,43 66,43 arc-90 70,39 70,20 70,4 arc-90 66,0 29,0 4,0 arc-90 0,4
IRIN  (via drill 0.3)
  Top 0.203: U1.22 29.47,8.13 v29.06,8.53
  Bottom 0.203: v29.06,8.53 29.06,7.11 31.09,5.28 31.09,3.05 31.5,2.64 58.52,2.64 60.35,4.47 60.35,6.91 60.96,7.52 62.59,7.52 64.82,9.75 66.34,9.75 U3.1
IROUT
  Top 0.203: U1.13 26.45,2 26.82,1.63 36.43,1.63 Q6.1
N$1
  Top 0.203: U1.23 31.59,8.93 R1.1
N$2
  Top 0.203: U1.24 31.79,9.73 R2.1
N$3
  Top 0.203: U1.25 31.79,11.23 R3.1
N$4
  Top 0.203: U1.26 28.05,11.79 28.45,12.19 30.89,12.19 31.29,12.6 31.66,12.6 R4.1
N$5
  Top 0.203: R5.1 30.23,13.77 29.06,12.6 28.19,12.6 27.79,12.19 27.64,12.19 27.28,11.84 27.28,11.28 U1.27
N$6
  Top 0.203: R6.1 28.75,13.77 27.79,12.8 27.43,12.8 26.47,11.84 26.47,11.28 U1.28
N$7
  Top 0.203: R7.1 27.23,13.77 26.26,12.8 25.86,12.8 24.89,11.84 24.89,11.28 U1.30
N$8
  Top 0.203: R8.1 25.76,13.77 25.76,13.51 24.08,11.84 24.08,11.28 U1.31
N$9
  Top 0.203: R9.1 24.23,13.77 24.23,12.8 23.27,11.84 23.27,11.28 U1.32
N$10
  Top 0.203: U1.1 21.75,11.39 22.76,12.39 22.76,13.78 R10.1
N$11
  Top 0.203: U1.2 21.62,9.07 20.8,9.07 20.73,9.14 20.73,11.99 21.13,12.39 21.13,13.66 R11.1
N$12  (via drill 0.3)
  Top 0.203: v19.86,12.72 19.86,13.7 R12.1 | U1.9 23.25,3.54 24.59,4.88 24.59,5.76 v24.54,5.61
  Bottom 0.203: v24.54,5.61 20.52,12.6 20.4,12.72 v19.86,12.72
N$13  (via drill 0.3)
  Top 0.203: v18.44,12.72 18.24,13.76 R13.1 | U1.10 24.05,3.32 25.4,4.67 25.4,5.76 v25.35,5.61
  Bottom 0.203: v25.35,5.61 25.35,5.94 20.73,13.41 18.93,13.41 18.44,12.93 v18.44,12.72
N$14  (via drill 0.3)
  Top 0.203: R14.1 16.77,12.98 v17.02,12.72 | U1.11 24.94,2.74 24.94,3.4 26.21,4.67 26.21,5.76 v26.16,5.61
  Bottom 0.203: v26.16,5.61 26.16,5.94 21.13,13.82 18.11,13.82 v17.02,12.72
N$15  (via drill 0.3)
  Top 0.203: v36.17,12.6 36.17,14.56 IR.K | Q6.3 36.17,6.08 v36.17,8.33
  Bottom 0.203: v36.17,8.33 v36.17,12.6
N$16  (via drill 0.3)
  Top 0.203: v31.29,14.63 15.66,14.63 R17.1
  Bottom 0.203: v31.29,14.63 31.36,14.63 IR.A
N$17
  Top 0.203: R15.2 9.44,6.91 6.91,6.91 6.5,7.32 6.5,9.75 6.91,10.16 6.91,13.59 6.5,14
  Top 0.55: U2.4 2.15,23.86 1.5,23.2 1.5,19.91 | U$14.VBUS 7.1,14.6 6.5,14 2.5,14 1.5,14.8 1.5,19.91 | 1.5,19.91 C5.1
N$18
  Top 0.203: LED63.C LED62.C LED61.C LED60.C LED59.C LED58.C 42.05,4.3 Q5.3
N$19
  Top 0.203: LED57.A 11.8,2.45 R15.1
N$20  (via drill 0.3)
  Top 0.203: U2.1 6.49,21.96 v6.91,21.54 | 9.35,4.7 LED57.C 9.58,4.47 v10.77,4.47
  Bottom 0.203: v6.91,21.54 7.52,21.54 8.94,20.32 8.94,19.3 8.33,18.69 7.5,17.86 7.5,11.5 8.33,10.67 8.33,8.53 10.77,6.1 v10.77,4.47
N$21
  Top 0.203: X1.2 17.72,3.32 C2.2 20.2,4.15 20.93,4.88 21.7,4.88 U1.7
N$22
  Top 0.203: U1.8 21.68,4.06 20.93,4.06 20.52,3.66 19.71,3.66 18.36,2.31 15.25,2.31 14.51,3.04 X1.1 14.51,5.95 C1.2
N$24  (via drill 0.3)
  Top 0.203: U2.5 2.9,22 v3.86,21.34 | v8.13,19.51 R16.2
  Bottom 0.203: v3.86,21.34 5.69,19.51 v8.13,19.51
N$25  (via drill 0.3)
  Top 0.203: v59.33,19.3 R18.2 | v59.33,13.01 BU2.B
  Bottom 0.203: v59.33,13.01 v59.33,19.3
N$27
  Top 0.203: U4.8 64.3,26.62 62.99,26.62 62.59,26.21 62.59,22.76 61.37,21.54 57.91,21.54 57.44,21.07 C8.1 56.22,20.73 54.66,20.73 53.68,19.75 R19.1 52.43,18.25 52.43,16.66 51.58,15.81 R20.1 R21.1
RESET  (via drill 0.3)
  Top 0.203: v28.45,9.96 26.01,9.96 25.6,10.36 25.6,11.18 U1.29 | R22.1 48.77,3.05 48.77,3.66 v49.38,4.27
  Bottom 0.203: P6.P$1 50.8,4.67 49.78,4.67 v49.38,4.27 48.56,3.45 35.76,3.45 29.26,9.96 v28.45,9.96
VBAT  (via drill 0.3)
  Top 0.55: v6.5,33 v6.5,34 6.25,33.75 SW1.NC | v6.5,25.2 v6.5,26.2 | C6.1 6.1,25.6 v6.5,25.2 | U2.3 6.5,24.85 v6.5,25.2
  Bottom 0.55: v6.5,25.2 6.5,24.95 | v6.5,25.2 v6.5,34 | P1.P$1 6.5,27.75 v6.5,25.2
VCC  (via drill 0.3)
  Top 0.203: C3.1 34.15,4.05 v34.34,3.86 | C7.1 66.38,14.8 U3.3 64.21,12.5 v64.21,10.57 59.94,10.57 v59.13,9.75 | R22.2 50.8,3.05 52.83,5.08 58.73,5.08 v58.93,4.88
  Top 0.55: U1.4 20.77,7.33 20.47,7.03 v20.47,6.91 20.47,6.63 | 20.47,6.63 v20.47,6.1 20.47,6.02 20.76,5.73 U1.6 23.21,5.73 24.18,6.71 26.62,6.71 28.39,4.93 U1.18 31.72,4.93 C3.1 | C4.1 18.64,7.85 19.86,6.63 20.47,6.63 | SW1.COM 4,30.75 v3.45,31.29 v2.85,31.29 | R17.2 13.13,19.39 v12.6,19.91
  Bottom 0.203: v34.34,3.86 34.34,3.25 34.54,3.05 58.12,3.05 59.44,4.37 | 59.44,4.37 59.74,4.67 59.74,7.11 60.76,8.13 62.38,8.13 64.21,9.96 v64.21,10.57 | v12.6,19.91 11.58,19.91 8.74,22.76 1.42,22.76 1.22,22.96 | P7.P$1 58.52,10.16 v59.13,9.75 | 59.44,4.37 v58.93,4.88
  Bottom 0.55: v3.45,31.29 1.83,31.29 1.22,30.68 1.22,22.96 1.22,9.75 2.03,8.94 5.69,8.94 8.53,6.1 8.53,2.44 9.14,1.63 19.91,1.63 20.47,2.19 v20.47,6.91

### Text on the board
tPlace: SW1 | Time | Start | Stop | Interval | Next | Duration | Setup | Set | CRG
bPlace: v4 | LiPo | POS | OSHW | LiPo | NEG | - | mo | + | SmallRoomLabs.com/ACsaver | rs | sc | mi